# EAGLE schematic main2 (EAGLE 8.6.1)
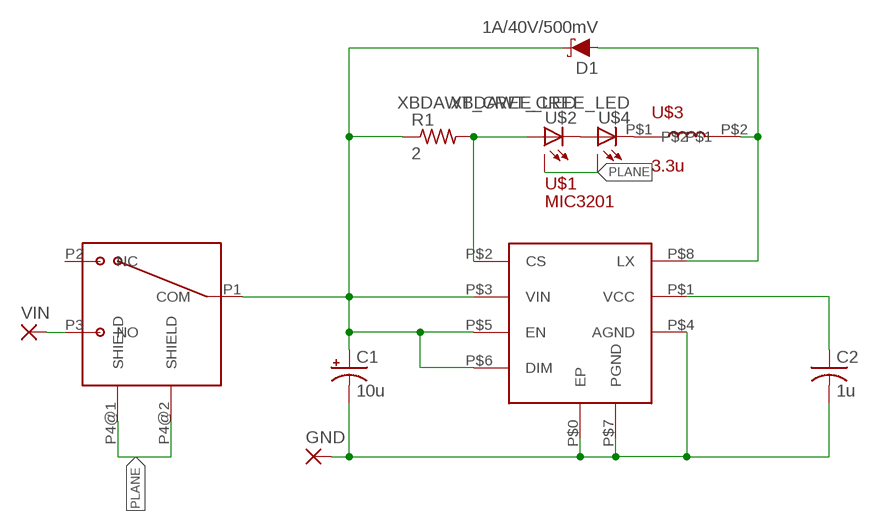
[diagram p0: schematic, sheet 1]

## Parts
C1  10u  CPOL-USE2-5  [E2-5]
C2  1u  C-USC0603K  [C0603K]
D1  1A/40V/500mV  DIODE-SCHOTTKY-SS14  [SMA-DIODE]
GND  2,54/1,0  [2,54/1,0]
R1  2  R-US_R0603  [R0603]
U$1  MIC3201  [SOICNEP-8LD-LP-1]
U$2  XBDAWT_CREE_LED  [XBDAWT]
U$3  3.3u  DO1813H  [DO1813H]
U$4  XBDAWT_CREE_LED  [XBDAWT]
U$5  SS312  [SS312]
VIN  2,54/1,0  [2,54/1,0]

## Nets
N$1: U$3.P$1 U$4.P$3(C)
N$2: C1.- C2.2 GND.1(P) U$1.P$0(EP) U$1.P$4(AGND) U$1.P$7(PGND)
N$3: C1.+ D1.C R1.1 U$1.P$3(VIN) U$1.P$5(EN) U$1.P$6(DIM) U$5.P1(COM)
N$4: C2.1 U$1.P$1(VCC)
N$5: R1.2 U$1.P$2(CS) U$2.P$2(A)
N$6: D1.A U$1.P$8(LX) U$3.P$2
N$7: U$2.P$3(C) U$4.P$2(A)
N$8: U$5.P3(NO) VIN.1(P)
PLANE: U$2.P$1(A1) U$4.P$1(A1) U$5.P4@1(SHIELD) U$5.P4@2(SHIELD)
Unconnected: U$5.P2(NC)

## Library data of the parts
C1 = rcl:CPOL-US: POLARIZED CAPACITOR, American symbol; SPICEPREFIX: C
C2 = rcl:C-US: CAPACITOR, American symbol; SPICEPREFIX: C
D1 = SparkFun-DiscreteSemi:DIODE-SCHOTTKY: Schottky diode A Schottky diode is a semiconductor diode which has a low forward voltage drop and a very fast switching action.; PROD_ID: DIO-08053
GND = 7_segment_lib:2,54/1,0: THROUGH-HOLE PAD
R1 = resistor:R-US_: RESISTOR, American symbol
U$1 = Micrel_By_element14_Batch_1:MIC3201
U$2 U$4 = 7_segment_lib:XBDAWT_CREE_LED
U$3 = 7_segment_lib:DO1813H
U$5 = 7_segment_lib:SS312
VIN = 7_segment_lib:2,54/1,0: THROUGH-HOLE PAD; SPICEPREFIX: X